# Altium schematic sheet PowerGroup.SchDoc
size A4
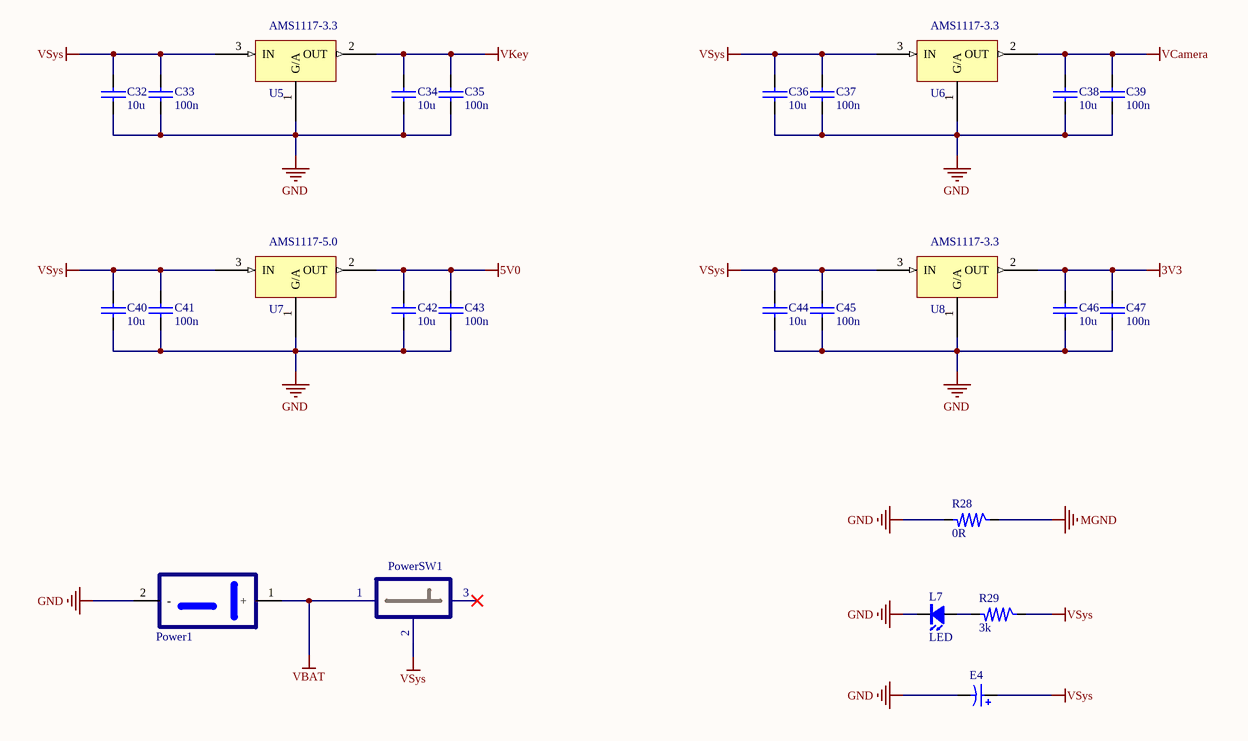
[diagram p0: PowerGroup.SchDoc]

## Parts
C32  10u  [C0805]
C33  100n  [C0603]
C34  10u  [C0805]
C35  100n  [C0603]
C36  10u  [C0805]
C37  100n  [C0603]
C38  10u  [C0805]
C39  100n  [C0603]
C40  10u  [C0805]
C41  100n  [C0603]
C42  10u  [C0805]
C43  100n  [C0603]
C44  10u  [C0805]
C45  100n  [C0603]
C46  10u  [C0805]
C47  100n  [C0603]
E4  Capacitor-Polarity  [CAP-E SMD-D]  (value not drawn)
L7  LED  [LED0805TB]
Power1  XT60  [T型头]  (value not drawn)
PowerSW1  Power  [NIUZI_SWITCH]  (value not drawn)
R28  0R  [R0603]
R29  3k  [R0603]
U5  AMS1117-3.3  [SOT223]
U6  AMS1117-3.3  [SOT223]
U7  AMS1117-5.0  [SOT223]
U8  AMS1117-3.3  [SOT223]

## Nets
3V3: C46.1 C47.1 U8.2(OUT)
5V0: C42.1 C43.1 U7.2(OUT)
GND: C32.2 C33.2 C34.2 C35.2 C36.2 C37.2 C38.2 C39.2 C40.2 C41.2 C42.2 C43.2 C44.2 C45.2 C46.2 C47.2 E4.2 L7.2(K) Power1.2(-) R28.1 U5.1(G/A) U6.1(G/A) U7.1(G/A) U8.1(G/A)
MGND: R28.2
VBAT: Power1.1(+) PowerSW1.1
VCamera: C38.1 C39.1 U6.2(OUT)
VKey: C34.1 C35.1 U5.2(OUT)
VSys: C32.1 C33.1 C36.1 C37.1 C40.1 C41.1 C44.1 C45.1 E4.1 PowerSW1.2 R29.2 U5.3(IN) U6.3(IN) U7.3(IN) U8.3(IN)
NetL7_1: L7.1(A) R29.1

Not connected (* = marked no-connect by the designer): PowerSW1 3*

## Library data of the parts
C32-C47 = Capacitor: 电容
E4 = Capacitor-Polarity: 极性电容
PowerSW1 = PowerSW
R28 R29 = Resistor: 电阻
U5-U8 = AMS1117-XX: 稳压芯片